# EAGLE design ls403_signal_encoder (EAGLE 5.11)
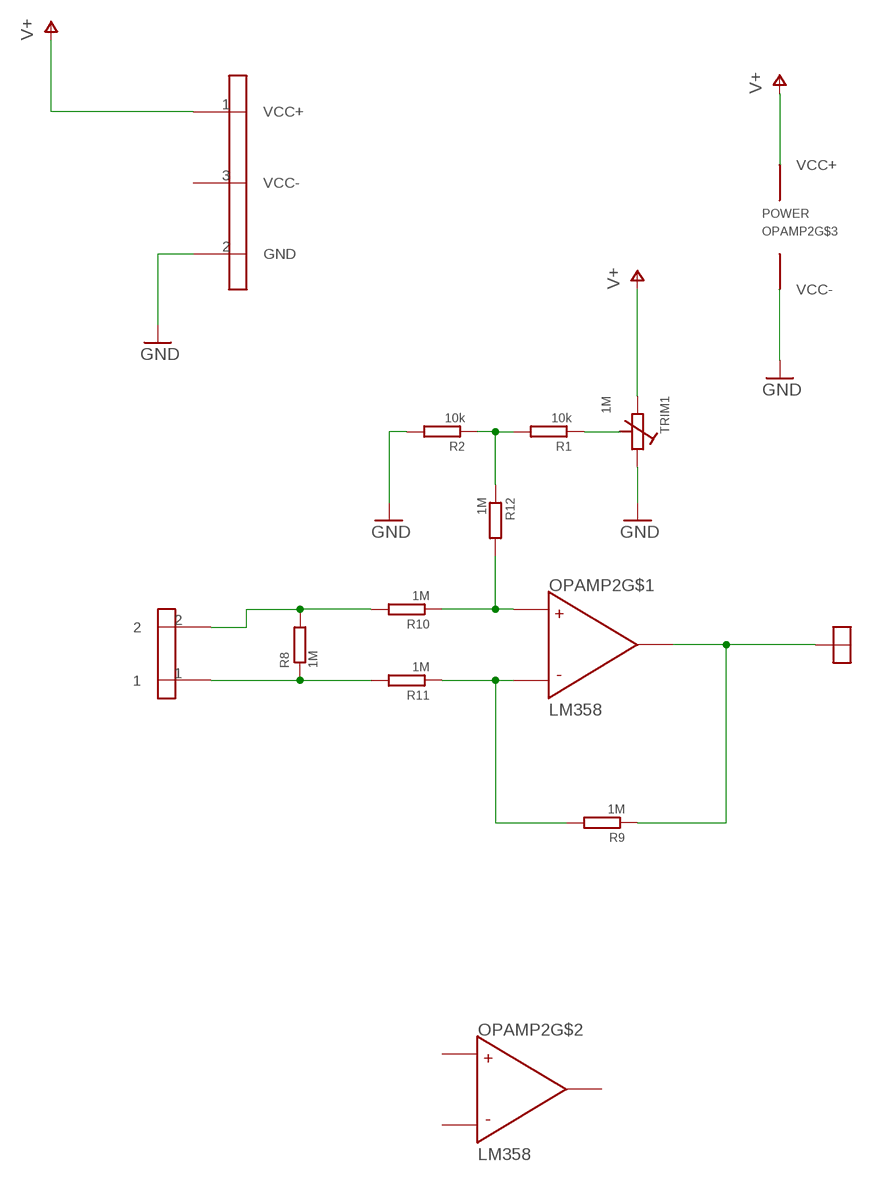
[diagram p0: schematic, sheet 1]

## Parts
CON1  1X_CON  [1X_CON]
CON3  DIFF_IN_CON  [DIFF_INPUT_CON]
OPAMP2  LM358  [DIL08]
R1  10k  R_EU1206  [R1206]
R2  10k  R_EU1206  [R1206]
R8  1M  R_EU0204/7  [0204/7]
R9  1M  R_EU0204/7  [0204/7]
R10  1M  R_EU0204/7  [0204/7]
R11  1M  R_EU0204/7  [0204/7]
R12  1M  R_EU0204/7  [0204/7]
TRIM1  1M  R_TRIM  [R_TRIM]
U$2  PWR_CON_RIMA  [POWER_CON]

## Nets
GND: OPAMP2.4(VCC-) R2.2 TRIM1.P$2 U$2.2(GND)
N$1: R1.2 R2.1 R12.1
N$2: R1.1 TRIM1.P$3(MIDDLE)
N$8: OPAMP2.3(NON_INVERT) R10.1 R12.2
N$9: CON3.2 R8.2 R10.2
N$11: CON3.1 R8.1 R11.2
N$12: OPAMP2.2(INVERT) R9.2 R11.1
N$13: CON1.P$1 OPAMP2.1(OUT) R9.1
V+: OPAMP2.8(VCC+) TRIM1.P$1 U$2.1(VCC+)
Unconnected: OPAMP2.5(NON_INVERT) OPAMP2.6(INVERT) OPAMP2.7(OUT) U$2.3(VCC-)

## Library data of the parts
CON1 = ls_403_signal_converter:1X_CON
CON3 = ls_403_signal_converter:DIFF_IN_CON
OPAMP2 = ls_403_signal_converter:LM358
R1 R2 R8-R12 = ls_403_signal_converter:R_EU
TRIM1 = ls_403_signal_converter:R_TRIM
U$2 = ls_403_signal_converter:PWR_CON_RIMA

## Board
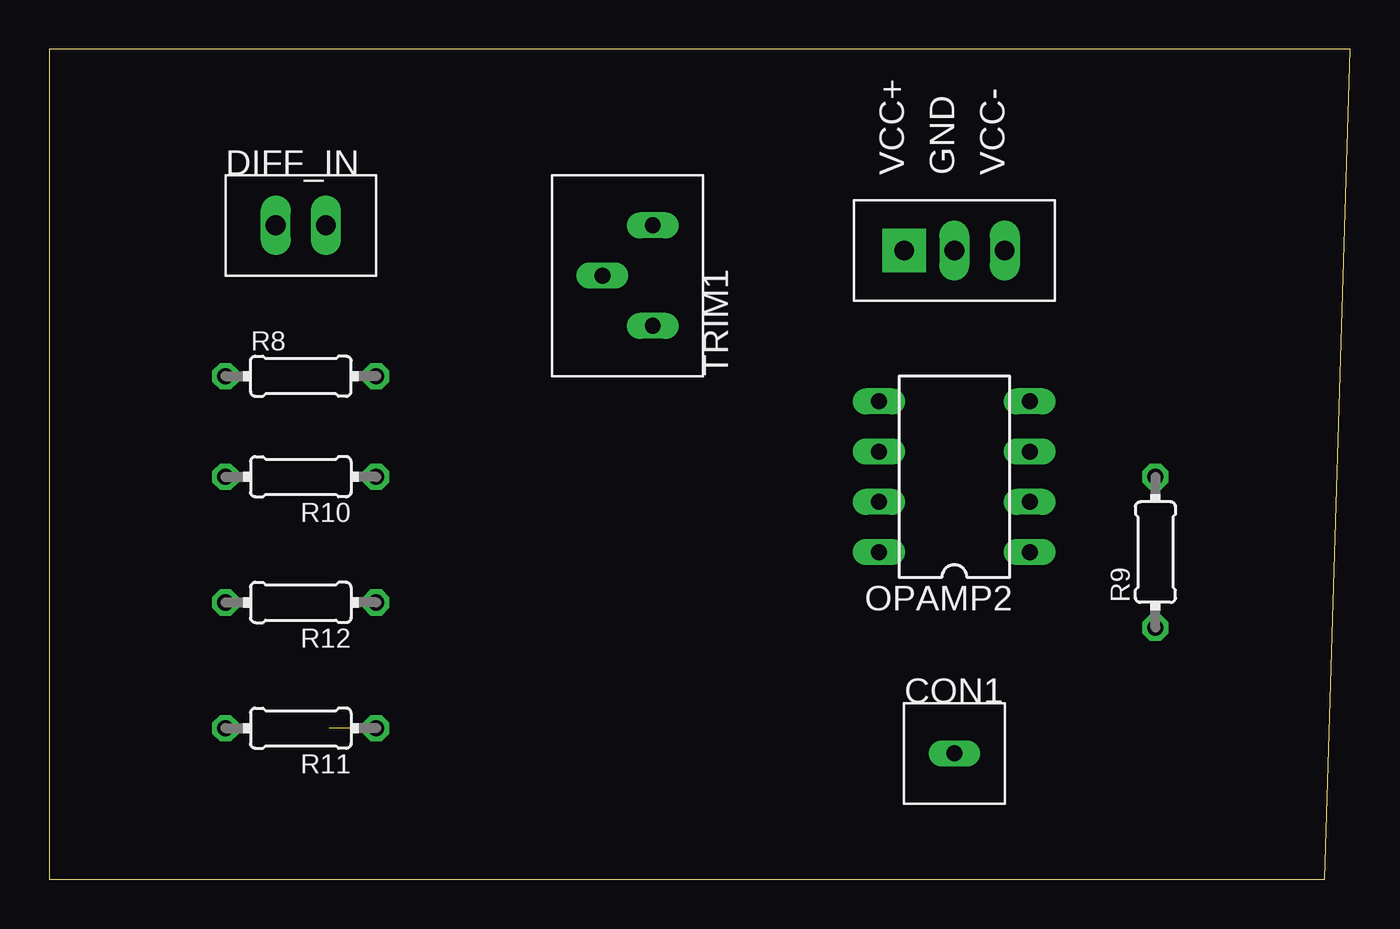
[diagram p1: board, top side]
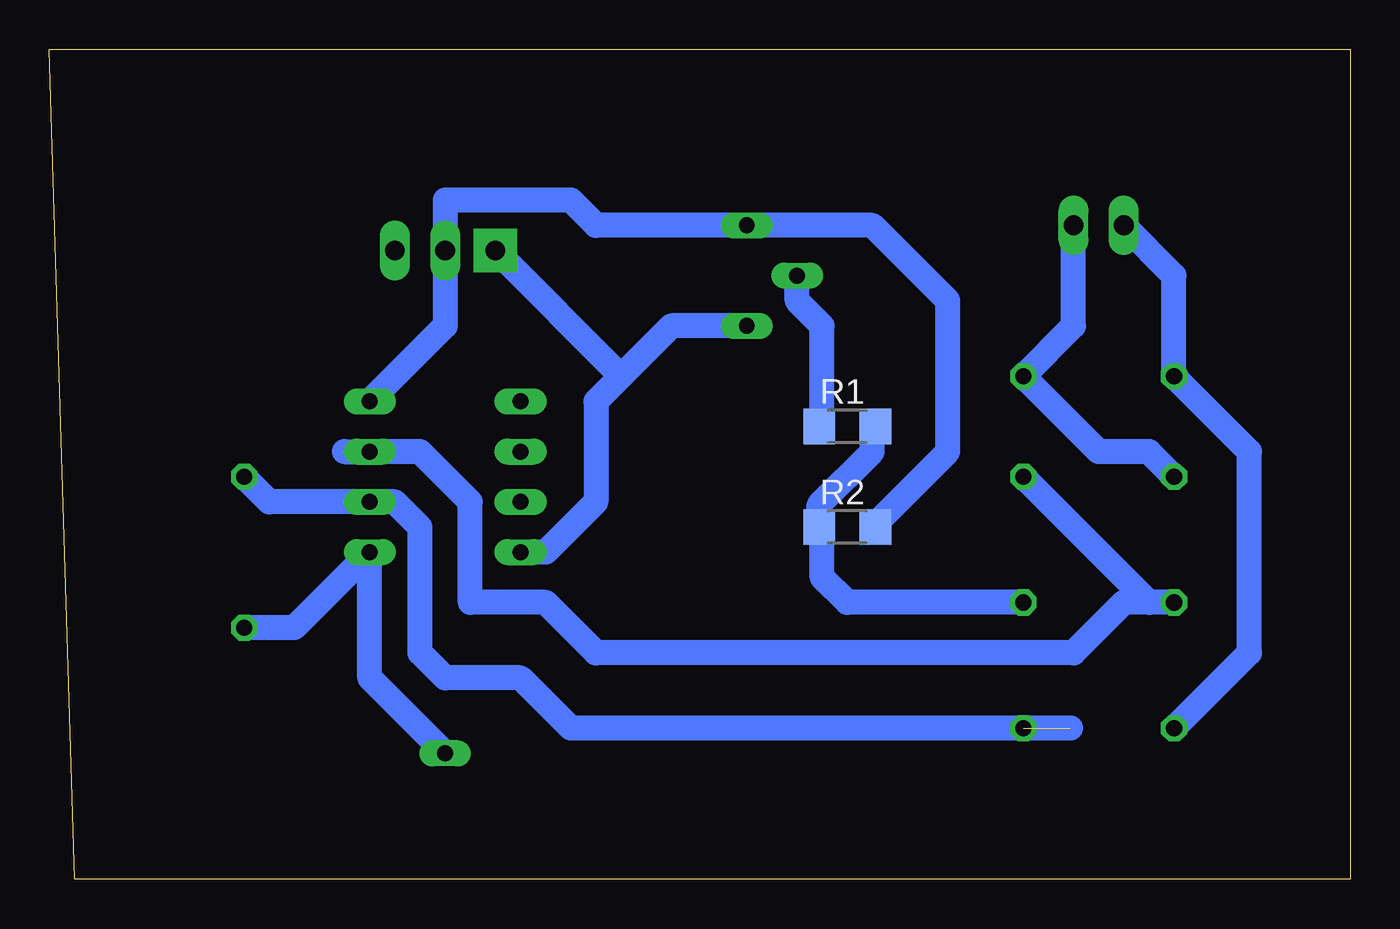
[diagram p2: board, bottom side, seen from below]

Size 65.71 x 41.9 mm. Coordinates in mm from the lower left corner, seen from the top.
Outline: 0,0 64.44,0 65.71,41.9 0,41.9 0,0
Copper layers (1*16): Top 0.035mm / dielectric 1.5mm / Bottom 0.035mm
Design rules "default": minimum track width 10mil, minimum drill 24mil, track to track 8mil, track to pad 8mil, pad to pad 8mil, via to via 8mil, smd to smd 8mil, copper to edge 40mil, drill to drill 8mil, minimum pad ring 10mil, minimum via ring 8mil, stop-mask expansion 4mil, vias tented up to drill 0mil, thermal gap 10mil

### Footprints (pad centres in the part's own frame; a part is rotated, then mirrored left to right if it is on the bottom)
1X_CON = drill 0.8 long: P$1 0,0
DIFF_INPUT_CON = drill 1 long: 1 -2.54,0; 2 0,0
DIL08 = drill 0.813 long: 1 -3.81,-3.81; 2 -1.27,-3.81; 3 1.27,-3.81; 4 3.81,-3.81; 5 3.81,3.81; 6 1.27,3.81; 7 -1.27,3.81; 8 -3.81,3.81
R1206 = smd 1.6 x 1.803: 1 -1.422,0; 2 1.422,0
0204/7 = drill 0.813 octagon: 1 -3.81,0; 2 3.81,0
R_TRIM = drill 0.8 long: P$1 -1.27,0; P$2 3.81,0; P$3 1.27,2.54
POWER_CON = drill 1 pad 2.184 square: 1 -2.54,0 | drill 1 long: 2 0,0; 3 2.54,0

### Placement (x,y rotation side)
CON1  45.72,6.35 0 top
CON3  13.97,33.02 0 top
OPAMP2  45.72,20.32 90 top
R1  25.4,22.86 0 bottom
R2  25.4,17.78 0 bottom
R8  12.7,25.4 0 top
R9  55.88,16.51 90 top
R10  12.7,20.32 180 top
R11  12.7,7.62 180 top
R12  12.7,13.97 180 top
TRIM1  30.48,29.21 90 top
U$2  45.72,31.75 0 top

### Tracks (layer width: path | path; a pad name or v marks a point on that pad's centre or on a via)
GND
  Bottom 1.27: OPAMP2.4 45.72,27.94 U$2.2 45.72,34.29 39.37,34.29 38.1,33.02 TRIM1.P$2 24.13,33.02 20.32,29.21 20.32,21.59 23.98,17.93 R2.2
N$1
  Bottom 1.27: R12.1 25.4,13.97 26.67,15.24 26.67,17.63 R2.1 26.82,18.9 24.13,21.59 24.13,22.71 R1.2
N$2
  Bottom 1.27: TRIM1.P$3 27.94,29.21 26.67,27.94 26.67,23.01 R1.1
N$8
  Bottom 1.27: R12.2 10.16,13.97 | R10.1 10.16,13.97 | 10.16,13.97 11.43,13.97 13.97,11.43 38.1,11.43 40.64,13.97 44.45,13.97 44.45,19.05 46.99,21.59 OPAMP2.3 50.8,21.59
N$9
  Bottom 1.27: CON3.2 13.97,27.94 R8.2 12.7,21.59 10.16,21.59 R10.2
N$11
  Bottom 1.27: CON3.1 8.89,30.48 R8.1 5.08,21.59 5.08,11.43 R11.2
N$12  (1 unrouted)
  Bottom 1.27: 14.12,7.62 39.37,7.62 41.91,10.16 45.72,10.16 46.99,11.43 46.99,17.78 48.26,19.05 OPAMP2.2 54.61,19.05 R9.2
N$13
  Bottom 1.27: CON1.P$1 49.53,10.16 OPAMP2.1 53.34,12.7 R9.1
V+
  Bottom 1.27: TRIM1.P$1 34.29,27.94 36.83,25.4 | 36.83,25.4 38.1,24.13 38.1,19.05 40.64,16.51 OPAMP2.8 | 36.83,25.4 U$2.1